# Altium schematic sheet HEAT_SINK.SchDoc
size A4; SheetNumber: 12; SheetTotal: 12
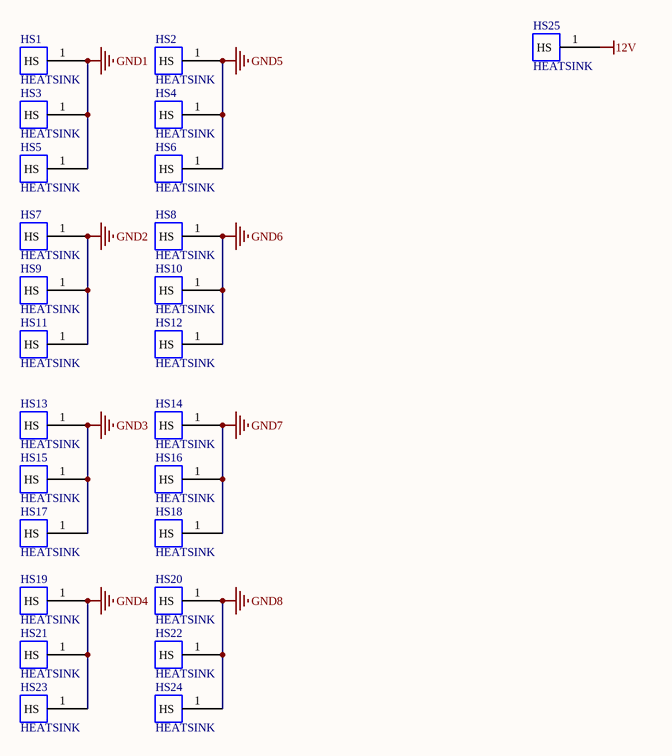
[diagram p0: HEAT_SINK.SchDoc]

## Parts
HS1  HEATSINK  [HEAT_SINK]
HS2  HEATSINK  [HEAT_SINK]
HS3  HEATSINK  [HEAT_SINK]
HS4  HEATSINK  [HEAT_SINK]
HS5  HEATSINK  [HEAT_SINK]
HS6  HEATSINK  [HEAT_SINK]
HS7  HEATSINK  [HEAT_SINK]
HS8  HEATSINK  [HEAT_SINK]
HS9  HEATSINK  [HEAT_SINK]
HS10  HEATSINK  [HEAT_SINK]
HS11  HEATSINK  [HEAT_SINK]
HS12  HEATSINK  [HEAT_SINK]
HS13  HEATSINK  [HEAT_SINK]
HS14  HEATSINK  [HEAT_SINK]
HS15  HEATSINK  [HEAT_SINK]
HS16  HEATSINK  [HEAT_SINK]
HS17  HEATSINK  [HEAT_SINK]
HS18  HEATSINK  [HEAT_SINK]
HS19  HEATSINK  [HEAT_SINK]
HS20  HEATSINK  [HEAT_SINK]
HS21  HEATSINK  [HEAT_SINK]
HS22  HEATSINK  [HEAT_SINK]
HS23  HEATSINK  [HEAT_SINK]
HS24  HEATSINK  [HEAT_SINK]
HS25  HEATSINK  [HEAT_SINK]

## Nets
12V: HS25.1(HS)
GND1: HS1.1(HS) HS3.1(HS) HS5.1(HS)
GND2: HS7.1(HS) HS9.1(HS) HS11.1(HS)
GND3: HS13.1(HS) HS15.1(HS) HS17.1(HS)
GND4: HS19.1(HS) HS21.1(HS) HS23.1(HS)
GND5: HS2.1(HS) HS4.1(HS) HS6.1(HS)
GND6: HS8.1(HS) HS10.1(HS) HS12.1(HS)
GND7: HS14.1(HS) HS16.1(HS) HS18.1(HS)
GND8: HS20.1(HS) HS22.1(HS) HS24.1(HS)

## Library data of the parts
HS1-HS25 = HEAT_SINK